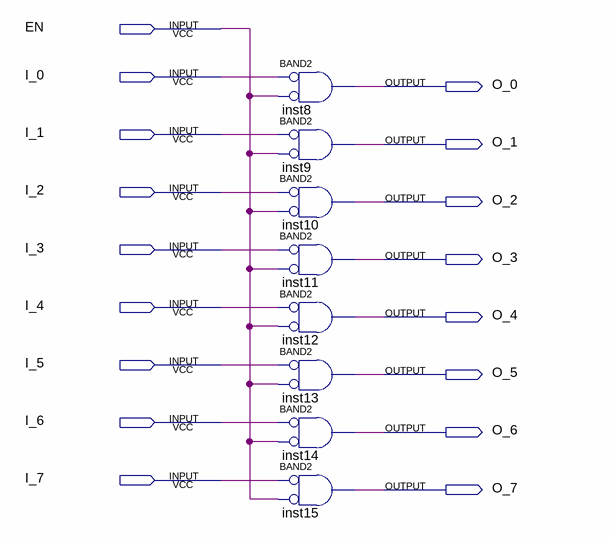
[diagram p0: schematic sheet]
// Quartus schematic AND_8x8.bdf as structural Verilog: 8 symbols, 17 pins
module AND_8x8 (
  input  EN,
  input  I_0,
  input  I_1,
  input  I_2,
  input  I_3,
  input  I_4,
  input  I_5,
  input  I_6,
  input  I_7,
  output O_0,
  output O_1,
  output O_2,
  output O_3,
  output O_4,
  output O_5,
  output O_6,
  output O_7
);

  and inst8 (O_0, ~I_0, ~EN);  // BAND2
  and inst9 (O_1, ~I_1, ~EN);  // BAND2
  and inst10 (O_2, ~I_2, ~EN);  // BAND2
  and inst11 (O_3, ~I_3, ~EN);  // BAND2
  and inst12 (O_4, ~I_4, ~EN);  // BAND2
  and inst13 (O_5, ~I_5, ~EN);  // BAND2
  and inst14 (O_6, ~I_6, ~EN);  // BAND2
  and inst15 (O_7, ~I_7, ~EN);  // BAND2
endmodule
